# EasyEDA schematic SCH_DC Speed controller PWM avarage voltage controlled load_2024-01-09.json
TITLE: PWM motor speed controller; REV: 1.1; Date: 2019-01-21; Sheet: 1/1; Drawn By: Joyvel
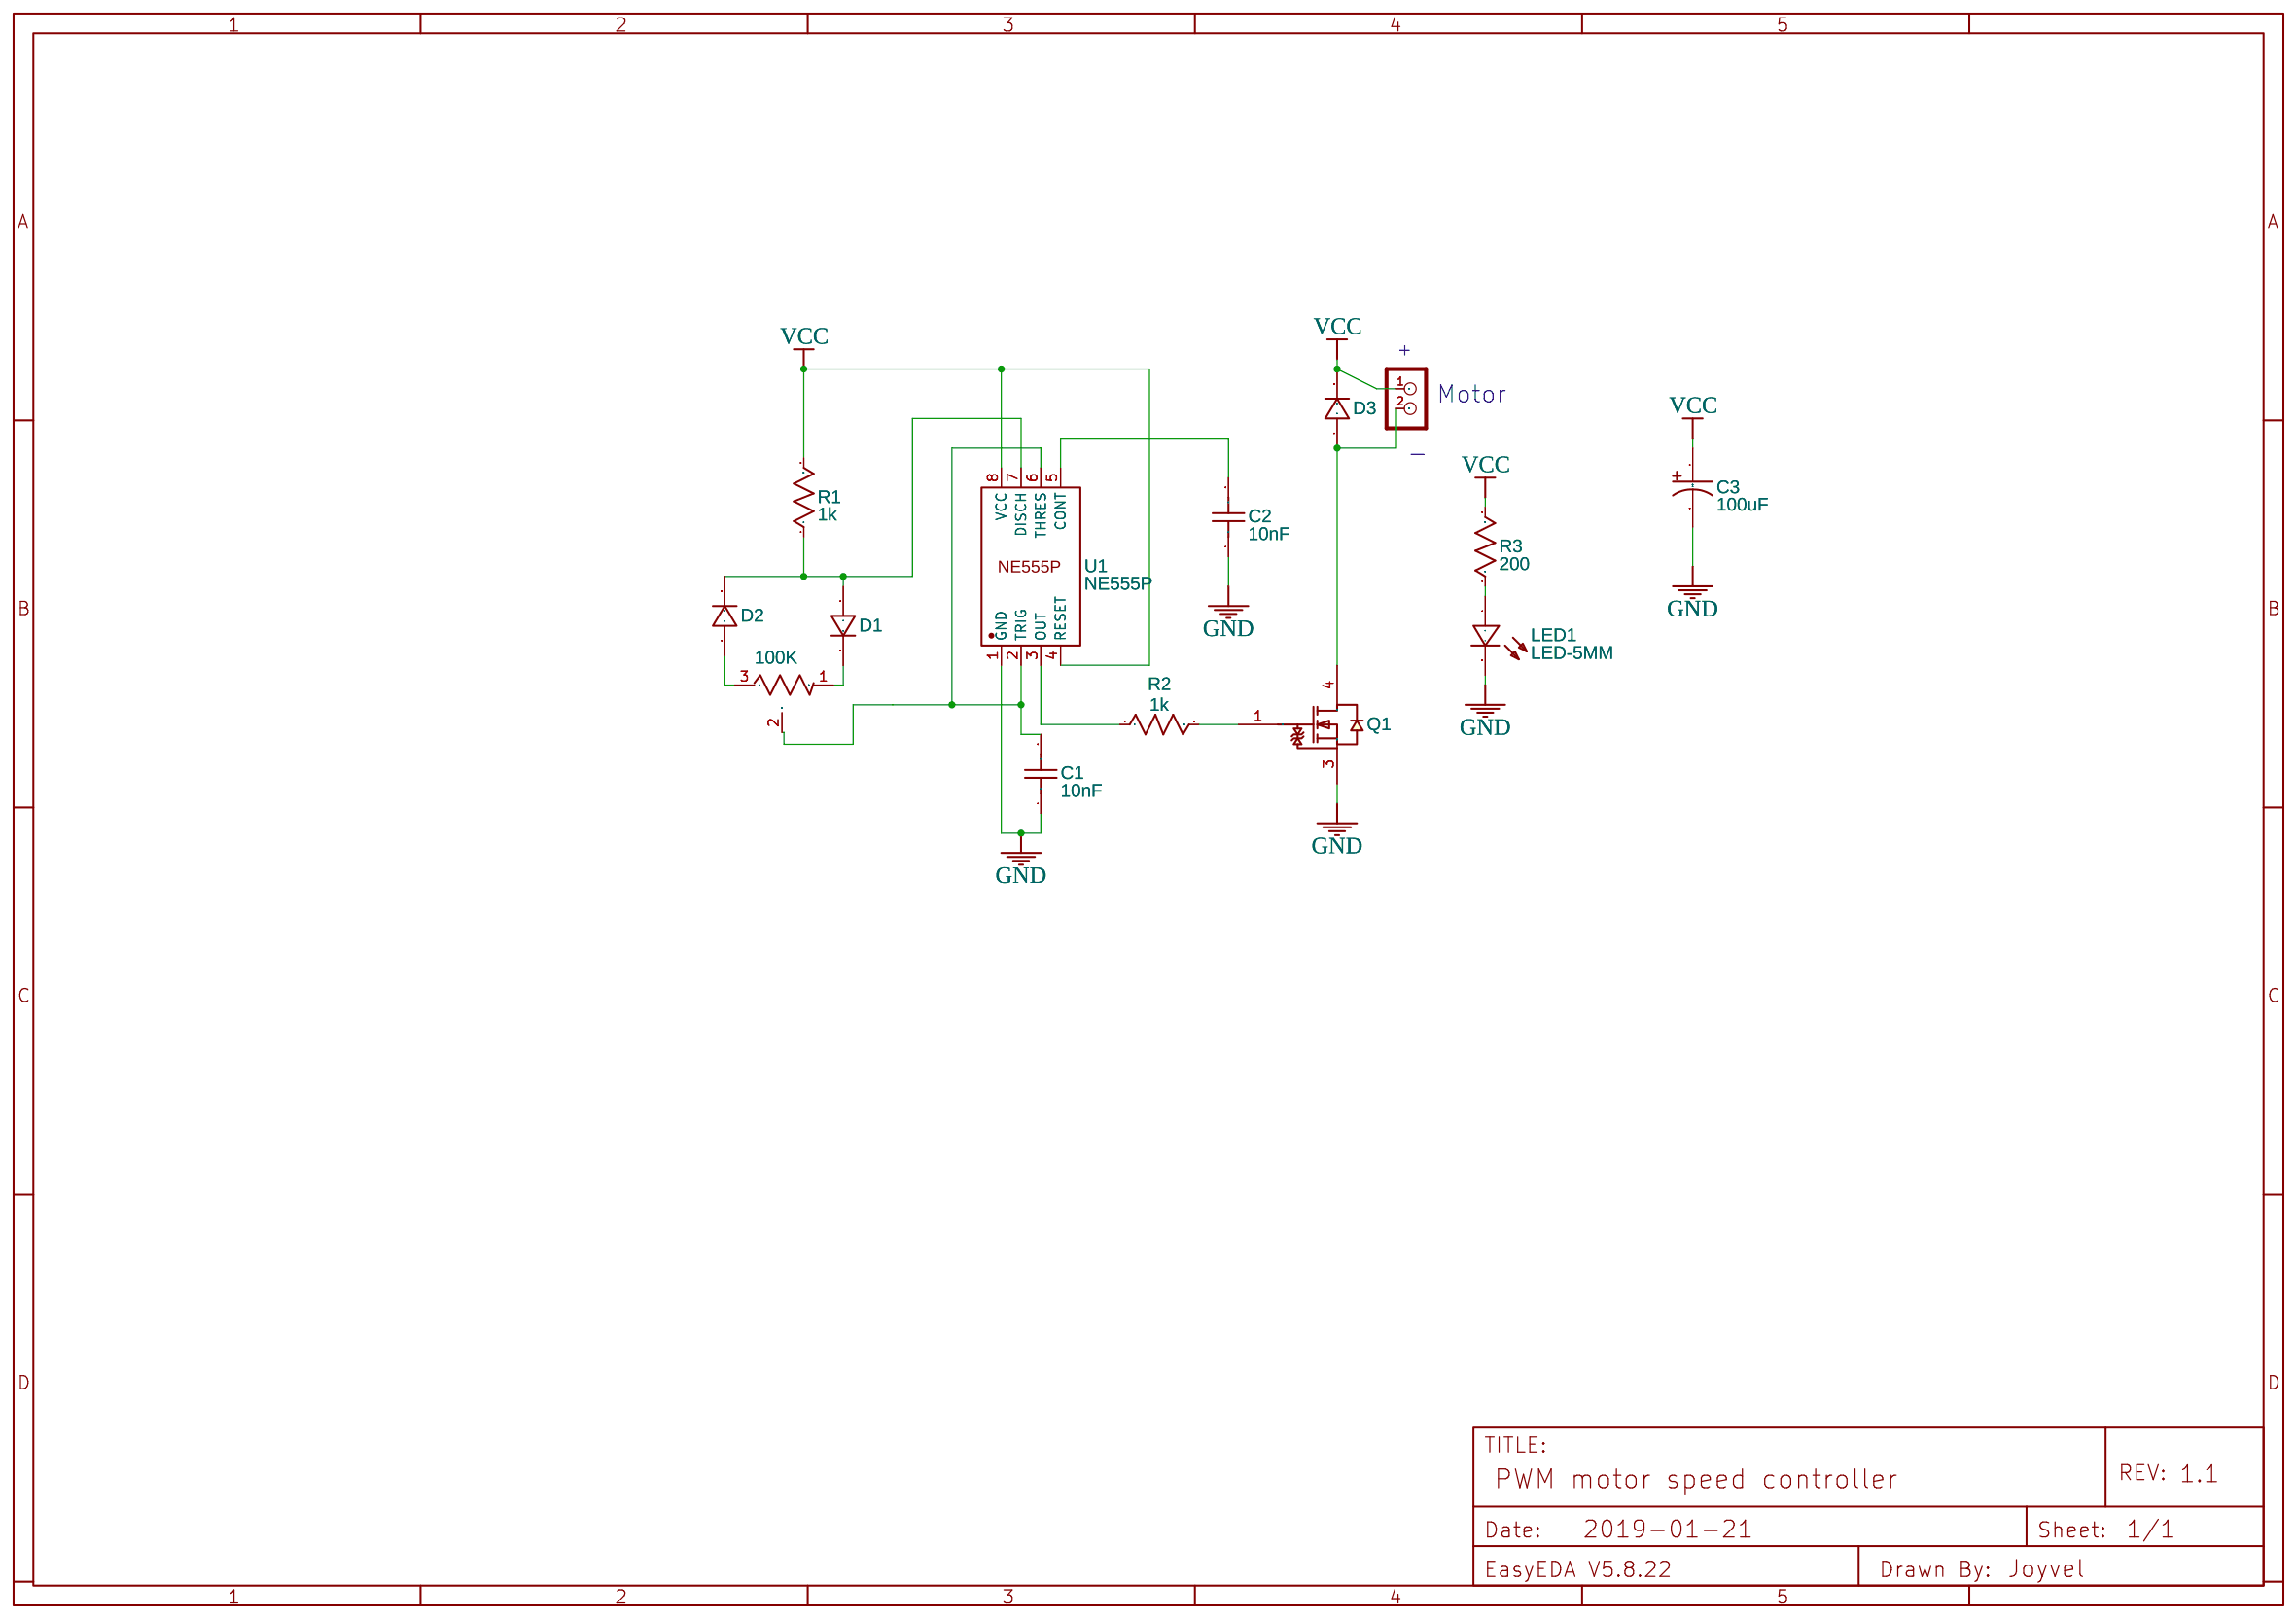
[diagram p0: schematic sheet]

## Parts
100K  100K  [POTENTIOMETER]
C1  10nF  [RAD-0.1]
C2  10nF  [RAD-0.1]
C3  100uF  [CAP-D3.0XF1.5]
D1  1N4448  [DO-35]
D2  1N4448  [DO-35]
D3  0  [DIODE]
J1  CON_TERMINAL_BLOCK_02  [TERMINAL_BLOCK_2P_5]
LED1  LED-5MM  [LED-5MM/2.54]
Q1  2SK4065-DL-1E  [ONSC-TO-263-2L-3_V]
R1  1k  [AXIAL-0.3]
R2  1k  [AXIAL-0.3]
R3  200  [AXIAL-0.3]
U1  NE555P  [DIP-8]

## Library data of the parts
100K = -: Manufacturer Part: ?; Supplier Part: undefined; link: https://www.aliexpress.com/item/10pcs-x-RV09-vertical-12-5mm-Shaft-5K-10K-50K-100K-0932-Adjustable-Resistor-9-type/32897258726.html?spm=a2g0s.9042311.0.0.7e294c4dTlaxAR; Contributor: Joyvel
C1 C2 = Cap_RAD-0.1_US: Manufacturer Part: ?
C3 = Cap_Electrolytic(TH)_D3.0XF1.5_US: Manufacturer Part: ?
D1 D2 = -: Supplier Part: C54037; Supplier: LCSC; Manufacturer: SEMTECH; image: //image.lceda.cn/szlcsc/C54037.jpg
D3 = -: Supplier Part: C54037; Supplier: LCSC; Manufacturer: SEMTECH; Manufacturer Part: 1N4448; image: //image.lceda.cn/szlcsc/C54037.jpg
J1 = -: Contributor: DangerousPrototype; Manufacturer Part: ?
LED1 = -: Supplier: LCSC; Manufacturer: EVERLIGHT; Manufacturer Part: 5AR2ST10; Supplier Part: C52721
Q1 = -: N-Channel Power MOSFET, 75 V, 100 A, 6 mOhm, 3-Pin TO-263, Pb-Free, Tape and Reel; Manufacturer Part: ?
R1-R3 = Res_AXIAL-0.3(1/8W)_US: Manufacturer Part: ?
U1 = -: Supplier Part: C46749; Supplier: LCSC; Manufacturer: TI; image: //image.lceda.cn/szlcsc/C46749.jpg; Contributor: LCSC

## Nets
GND: C1.1 C2.1 C3.2 LED1.2(-) Q1.3(S) U1.1(GND)
VCC: C3.1 D3.2(K) J1.1 R1.2 R3.2 U1.4(RESET) U1.8(VCC)
Net-(100K-1): 100K.1 D1.2(K)
Net-(100K-2): 100K.2 C1.2 U1.2(TRIG) U1.6(THRES)
Net-(100K-3): 100K.3 D2.1(A)
Net-(C2-2): C2.2 U1.5(CONT)
Net-(D1-1): D1.1(A) D2.2(K) R1.1 U1.7(DISCH)
Net-(D3-1): D3.1(A) J1.2 Q1.4(D)
Net-(LED1-1): LED1.1(+) R3.1
Net-(Q1-1): Q1.1(G) R2.2
Net-(R2-1): R2.1 U1.3(OUT)

## Notes on the sheet
- +
- Motor
- -
